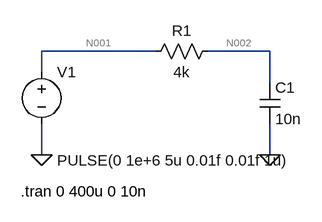
[diagram p0: schematic RC-цепь (delta).asc]
RC-цепь (delta).asc, the LTspice schematic file:
Version 4
SHEET 1 880 680
WIRE 80 16 -96 16
WIRE 256 16 160 16
WIRE -96 48 -96 16
WIRE 256 64 256 16
WIRE -96 176 -96 128
WIRE 256 176 256 128
FLAG -96 176 0
FLAG 256 176 0
SYMBOL voltage -96 32 R0
WINDOW 3 24 152 Left 2
WINDOW 123 0 0 Left 0
WINDOW 39 24 180 Left 2
SYMATTR Value PULSE(0 1e+6 5u 0.01f 0.01f 1u)
SYMATTR InstName V1
SYMBOL res 176 0 R90
WINDOW 0 0 56 VBottom 2
WINDOW 3 32 56 VTop 2
SYMATTR InstName R1
SYMATTR Value 4k
SYMBOL cap 240 64 R0
SYMATTR InstName C1
SYMATTR Value 10n
TEXT -128 232 Left 2 !.tran 0 400u 0 10n

The netlist it stands for:
* RC-цепь (delta).asc
V1 N001 0 PULSE(0 1e+6 5u 0.01f 0.01f 1u)
R1 N002 N001 4k
C1 N002 0 10n
.tran 0 400u 0 10n
.backanno
.end

* Results of the author's LTspice run, read from the files saved beside the schematic
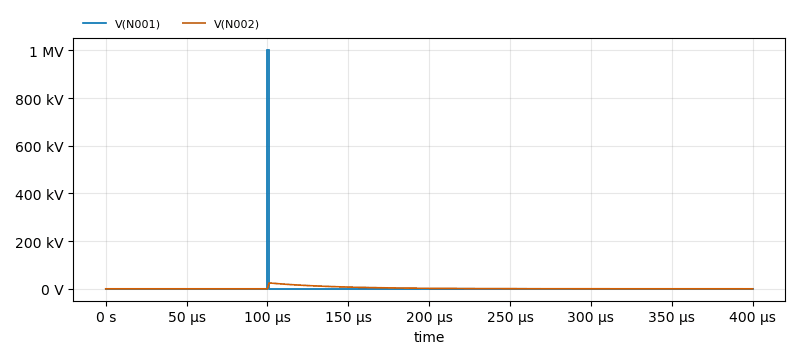
[diagram p1: Transient Analysis of RC-цепь (delta).asc, plotted from the saved traces]
* Transient Analysis, 1 run:
*   V(N001): min 0 V, max 1 MV, average 2.5 kV, rms 50 kV, last 0 V
*   V(N002): min 0 V, max 24.69 kV, average 2.502 kV, rms 5.587 kV, last 14 V